# Altium schematic sheet Regulador5V.SchDoc: Sanhaço - Regulador 5v
size A4; DocumentNumber: CB02; Revision: 1.1; SheetNumber: 2; SheetTotal: 4; ProjectName: Sanhaço
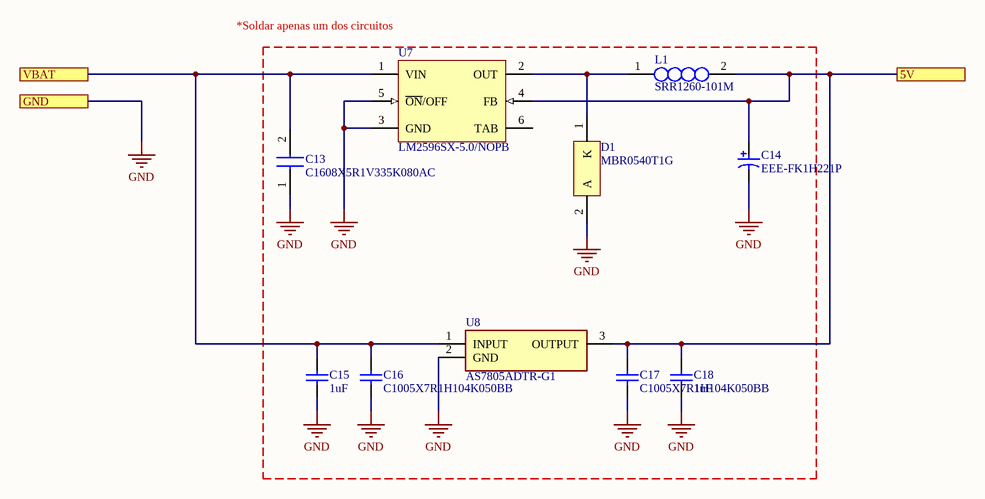
[diagram p0: Regulador5V.SchDoc]

## Parts
C13  C1608X5R1V335K080AC  [CAPC1608X80N]
C14  EEE-FK1H221P  [PNSC-EEE-1HA221P_L]
C15  1uF  [CAPC1608X90X35ML10T15]
C16  C1005X7R1H104K050BB  [TDK-C1005-2_M]
C17  C1005X7R1H104K050BB  [TDK-C1005-2_M]
C18  1uF  [CAPC1608X90X35ML10T15]
D1  MBR0540T1G  [ONSC-SOD-123-2-425-04_V]
L1  SRR1260-101M  [*INDP125125X600N]
U7  LM2596SX-5.0/NOPB  [TS5B_M]
U8  AS7805ADTR-G1  [ZLDO1117K50TC]

## Ports
5V, GND, VBAT

## Nets
GND: C13.1 C14.2 C15.1 C16.1 C17.1 C18.1 D1.2(A) U7.3(GND) U7.5(~{ON}/OFF) U8.2(GND) ; port GND
5V: C14.1 C17.2 C18.2 L1.2 U7.4(FB) U8.3(OUTPUT) ; port 5V
VBAT: C13.2 C15.2 C16.2 U7.1(VIN) U8.1(INPUT) ; port VBAT
NetD1_1: D1.1(K) L1.1 U7.2(OUT)

Not connected (* = marked no-connect by the designer): U7 6(TAB)

## Notes on the sheet
- (near U7) *Soldar apenas um dos circuitos
- Title
- Size:
- Date:
- A4
- Number:
- Time:
- Revision:
- Sheet
- of
- File:

## Library data of the parts
C13 = C1608X5R1V335K080AC: Capacitor 3.3uF; Manufacturer_Name: TDK; Dielectric Material: Ceramic; Tolerance: 10%; Voltage Rating: 35V; Dielectric: X5R; Datasheet Link: https://product.tdk.com/info/en/catalog/datasheets/mlcc_commercial_midvoltage_en.pdf; Height: 0.8mm; Manufacturer_Part_Number: C1608X5R1V335K080AC; Mouser Part Number: 810-C1608X5R1V335KAC; Mouser Price/Stock: https://www.mouser.com/Search/Refine.aspx?Keyword=810-C1608X5R1V335KAC; Supplier 1: Digi-Key; Supplier Part Number 1: 445-14167-1-ND; Manufacturer: TDK; Manufacturer Part Number: C1608X5R1V335K080AC; Stock 1: 4798; Pricing 1: 1 = 0,45000, 10 = 0,31100, 100 = 0,18630, 500 = 0,13972, 1000 = 0,11799 (USD); RoHS: Yes; Mount: Surface Mount; Case/Package: 0603; Weight: 7.1E-05oz; Case Code (Metric): 1608; Case Code (Imperial): 0603; Min Operating Temperature: -55°C; Max Operating Temperature: 85°C; Package Quantity: 4000; Packaging: Tape and Reel; Capacitance: 3.3uF; Termination: SMD/SMT; Voltage Rating (DC): 35V; Length: 0.063inch; Width: 0.8mm; Thickness: 0.035inch; Lead Free: Lead Free; ComponentLink1URL: https://datasheet.ciiva.com/14909/tdkmlcccaprange-14909925.pdf?src-supplier=Digi-Key; ComponentLink1Description: https://datasheet.ciiva.com/14909/tdkmlcccaprange-14909925.pdf?src-supplier=Digi-Key; ComponentLink2URL: https://datasheet.ciiva.com/14909/tdkmlcccaprange-14909926.pdf?src-supplier=Digi-Key; ComponentLink2Description: https://datasheet.ciiva.com/14909/tdkmlcccaprange-14909926.pdf?src-supplier=Digi-Key
C14 = CMP-2000-06200-1: Aluminum Electrolytic Capacitor, 220 uF, +/- 20%, 50 V, -40 to 85 degC, 2-Pin SMD, RoHS, Tape and Reelhttps://br.mouser.com/ProductDetail/Panasonic/EEE-FK1H221P?qs=%2Fha2pyFaduioJWBrqH8qNcijPCQSw77%252BpLytlHuDdeup2lEE5e2lgA%3D%3D; Lifetime @ Temperature: 2000hours@85°C; AE Capacitor Case: RadialCan-SMD; Capacitance: 220µF; Ripple Current AC: 300mA; SVHC: ToBeAdvised; Voltage Rating: 50V; Product Range: PANASONIC-SSeries; Manufacturer: Panasonic; Datasheet Version: 11/2012; Manufacturer URL: http://www.panasonic.com/; Packaging: CutTape; Life Time @ Temperature: 2000hours@85°C; Capacitor Case Style: RadialCan-SMD; Capacitance Tolerance ±: ±20%; Mounting Technology: SurfaceMount; Operating Temperature Max: 85°C; Capacitance Tolerance: ±20%; Package Description: 2-Pin Surface Mount Device, Body 10.3 x 10.3 mm; Package Reference: SMD; Diameter: 10mm; Height: 10.2mm; Operating Temperature Min: -40°C; Datasheet URL: https://br.mouser.com/datasheet/2/315/ABA0000C1181-947564.pdf
C15 C18 = CMP-2006-02823-1: MURATA   GRM188R61H105KAALD   Multilayer Ceramic Capacitor, GRM Series, 1 F,  10%, X5R, 50 V, 0603 [1608 Metric]; Dielectric: X7R; Voltage Rating: 50V; Manufacturer: Murata; Part Number: GRM188R61H105KAALD; Supplier 1: Mouser; Supplier Part Number 1: 81-GRM188R61H105KALD; Manufacturer Part Number: GRM188R61H105KAALD; Stock 1: 0; Mount: Surface Mount; Case/Package: 0603; Weight: 0.000222oz; Case Code (Metric): 1608; Case Code (Imperial): 0603; Material: Ceramic; Min Operating Temperature: -55°C; Max Operating Temperature: 85°C; Capacitance: 1uF; Tolerance: 10%; Packaging: Tape and Reel; Voltage: 50V; Termination: SMD/SMT; Composition: Ceramic; Voltage Rating (DC): 50V; Package Quantity: 4000; Length: 1.6mm; Height: 0.8mm; Width: 0.8mm; Thickness: 0.035inch; Depth: 0.8mm; Radiation Hardening: No; REACH SVHC: No SVHC; Lead Free: Lead Free; ComponentLink1URL: http://www.farnell.com/datasheets/2048611.pdf?src-supplier=Newark; ComponentLink1Description: http://www.farnell.com/datasheets/2048611.pdf?src-supplier=Newark; ComponentLink2URL: http://www.farnell.com/datasheets/1747450.pdf?src-supplier=Element14; ComponentLink2Description: http://www.farnell.com/datasheets/1747450.pdf?src-supplier=Element14; ComponentLink3URL: https://www.distrelec.biz/Web/Downloads/_t/ds/murata_MLCC_eng_tds.pdf?mime=application%2Fpdf&src-supplier=Distrelec; ComponentLink3Description: https://www.distrelec.biz/Web/Downloads/_t/ds/murata_MLCC_eng_tds.pdf?mime=application%2Fpdf&src-supplier=Distrelec; Datasheet: https://br.mouser.com/datasheet/2/281/murata_03052018_GRM_Series_1-1310166.pdf
C16 C17 = CMP-2000-05393-1: Chip Capacitor, 0.1 uF, +/- 10%, 50 V, -55 to 125 degC, 0402(1005 Metric), RoHS, Tape and Reel; PCN Part Number: MLCCPartNumberChange30/Nov/2012; Manufacturer: TDK; Product Training Modules: CSeriesGeneralApplicationsSEAT,CCV,andTVCLDesignToolsGuidetoReplacinganElectrolyticCapacitorwithanMLCC; Other Names: 445-5932-1; Kits: 445-9021-KIT-ND-KITMLCC100PF-10UF04026.3-50V445-9003-KIT-ND-KITCAPCERHICAPMLCCSMD; Voltage - Rated: 50V; Temperature Coefficient: X7R; Capacitance: 0.1µF; Online Catalog: CSeries,GeneralPurpose; Manufacturer URL: http://www.tdk.com/; Category: Capacitors; Mounting Type: SurfaceMount,MLCC; Datasheet Version: Mar-15; Datasheet URL: http://www.farnell.com/datasheets/1913358.pdf; Packaging: CutTape(CT); Standard Package: 1; Features: -; Operating Temperature: -55degC~125degC; Tolerance: ±10%; RoHS Information: RoHSCertificate-MLCC; Applications: GeneralPurpose; Lead Style: -; Ratings: -; Height - Seated (Max): -; Lead Spacing: -; Package / Case: 0402(1005Metric); Series: C; Family: CeramicCapacitors
D1 = CMP-1055-00401-1: Schottky Power Rectifier, 2-Pin SOD-123, Pb-Free, Tape and Reel; Manufacturer: On Semiconductor; IFSM Max (A): 5.5; Configuration: Single; ComponentLink1URL: http://www.onsemi.com/; ComponentLink3Description: Package Specification; RoHS: TRUE; PackageVersion: Rev. G, 10/2009; DatasheetVersion: Rev. 7; ComponentLink3URL: http://www.onsemi.com/pub_link/Collateral/425-04.PDF; Packing: Tape and Reel; ComponentLink1Description: Manufacturer URL; PackageDescription: 2-Pin SOD, Body 1.6 x 2.69 mm; PartNumber: MBR0540T1G; ComponentLink2Description: Datasheet; ComponentLink2URL: http://www.onsemi.cn/pub_link/Collateral/MBR0540T1-D.PDF; PackageReference: SOD-123-2-425-04; Mounting Technology: Surface Mount; Datasheet: https://br.mouser.com/datasheet/2/315/ABA0000C1181-947564.pdf
L1 = SRR1260-220M: FIXED IND 100UH 1.7A 180 MOHM; Manufacturer_Name: Bourns; Allied_Number: 70277063; Core Material: Ferrite; Material: Steel; Tolerance: 20%; DC Resistance (DCR): 180mR; Shielding: Shielded; Self Resonant Frequency: 6.07MHz; Q Factor: 26; Test Frequency: 100kHz; Datasheet Link: https://componentsearchengine.com/Datasheets/2/SRR1260-220M.pdf; Manufacturer_Part_Number: SRR1260-220M; Mouser Part Number: 652-SRR1260-220M; Mouser Price/Stock: https://www.mouser.com/Search/Refine.aspx?Keyword=652-SRR1260-220M; RS Part Number: 7272246P; RS Price/Stock: http://uk.rs-online.com/web/p/products/7272246P; Allied Price/Stock: https://www.alliedelec.com/bourns-srr1260-220m/70277063/; Supplier 1: Mouser; Supplier Part Number 1: 652-SRR1260-101M; Manufacturer: Bourns; Manufacturer Part Number: SRR1260-101M; Stock 1: 6993; Pricing 1: 1=0.97, 10=0.833, 50=0.694, 100=0.652, 1000=0.447, 10000=0.446 (USD); Mount: Surface Mount; Case/Package: 1260; Number of Pins: 2; Min Operating Temperature: -40°C; Max Operating Temperature: 125°C; Inductance: 100uH; Max DC Current: 1.7A; Termination: SMD/SMT; Package Quantity: 600; Current Rating: 1.7A; Saturation Current: 1.7A; Packaging: Tape and Reel; Frequency: 6.07MHz; Inductance Tolerance: 20%; Resistance: 180MR; Composition: Wirewound; RMS Current (Irms): 1.7A; DC Current: 1.7A; Military Standard: Not; Length: 12.5mm; Height: 6mm; Width: 12.5mm; Height - Seated (Max): 0.256inch; Depth: 12.8mm; REACH SVHC: No SVHC; ComponentLink1URL: http://www.bourns.com/docs/Product-Datasheets/SRR1260.pdf?src-supplier=Digi-Key; ComponentLink1Description: http://www.bourns.com/docs/Product-Datasheets/SRR1260.pdf?src-supplier=Digi-Key; ComponentLink2URL: http://uk.rs-online.com/webdocs/0def/0900766b80defded.pdf?src-supplier=RSComponents; ComponentLink2Description: http://uk.rs-online.com/webdocs/0def/0900766b80defded.pdf?src-supplier=RSComponents; ComponentLink3URL: http://www.farnell.com/datasheets/1430852.pdf?src-supplier=Element14; ComponentLink3Description: http://www.farnell.com/datasheets/1430852.pdf?src-supplier=Element14; ComponentLink4URL: http://www.farnell.com/datasheets/1914016.pdf?src-supplier=Element14; ComponentLink4Description: http://www.farnell.com/datasheets/1914016.pdf?src-supplier=Element14; ComponentLink5URL: http://www.bourns.com/pdfs/SRR1260.pdf?src-supplier=Avnet; ComponentLink5Description: http://www.bourns.com/pdfs/SRR1260.pdf?src-supplier=Avnet; ComponentLink6URL: http://www.farnell.com/datasheets/2366825.pdf?src-supplier=Newark; ComponentLink6Description: http://www.farnell.com/datasheets/2366825.pdf?src-supplier=Newark; ComponentLink7URL: https://www.alliedelec.com/m/d/845565468e1e76a1db638ca94afd232b.pdf?src-supplier=Allied+Electronics; ComponentLink7Description: https://www.alliedelec.com/m/d/845565468e1e76a1db638ca94afd232b.pdf?src-supplier=Allied+Electronics
U7 = CMP-0069-00282-2: SIMPLE SWITCHER® Power Converter 150 KHz 3A Step-Down Voltage Regulator, 5-pin TO-263; Manufacturer: Texas Instruments; PowerWise: N; PackageTopMarking: NSUZXYTTE#*LM2596S*-5.0 P+; RevisionNote: Component URLs added; ComponentLink3URL: http://www.national.com/packaging/folders/ts5b.html; Code_JEDEC: MO-169-AB; ComponentLink1Description: LM2596 Datasheet; DatasheetVersion: May-2002; ComponentLink2Description: LM2596 Web Page; PackageReference: TS5B; PackageDescription: TO-263, Molded, .400 x .390 x .180in, 5 Lead, .067in Pitch, Surface Mount; CompType: Switcher; ComponentLink1URL: http://www.national.com/ds/LM/LM2596.pdf; ComponentLink3Description: TS5B Package Page; PinCount: 5; RoHS: N; ComponentLink2URL: http://www.national.com/pf/LM/LM2596.html
U8 = AS7805ADTR-G1: Integrated Circuit; Manufacturer_Name: Diodes Inc.; Datasheet Link: https://www.diodes.com/assets/Datasheets/AS78XXA.pdf; Height: 2mm; Manufacturer_Part_Number: AS7805ADTR-G1; Mouser Part Number: 621-AS7805ADTR-G1; Mouser Price/Stock: https://www.mouser.com/Search/Refine.aspx?Keyword=621-AS7805ADTR-G1